# Altium schematic sheet TEMPLATE_Circuit.SchDoc
size Tabloid; Date: Date; Author: Author 1; Revision: 1; SheetNumber: 3; SheetTotal: 3; Size: 11x17; Sheet_Name: Circuit
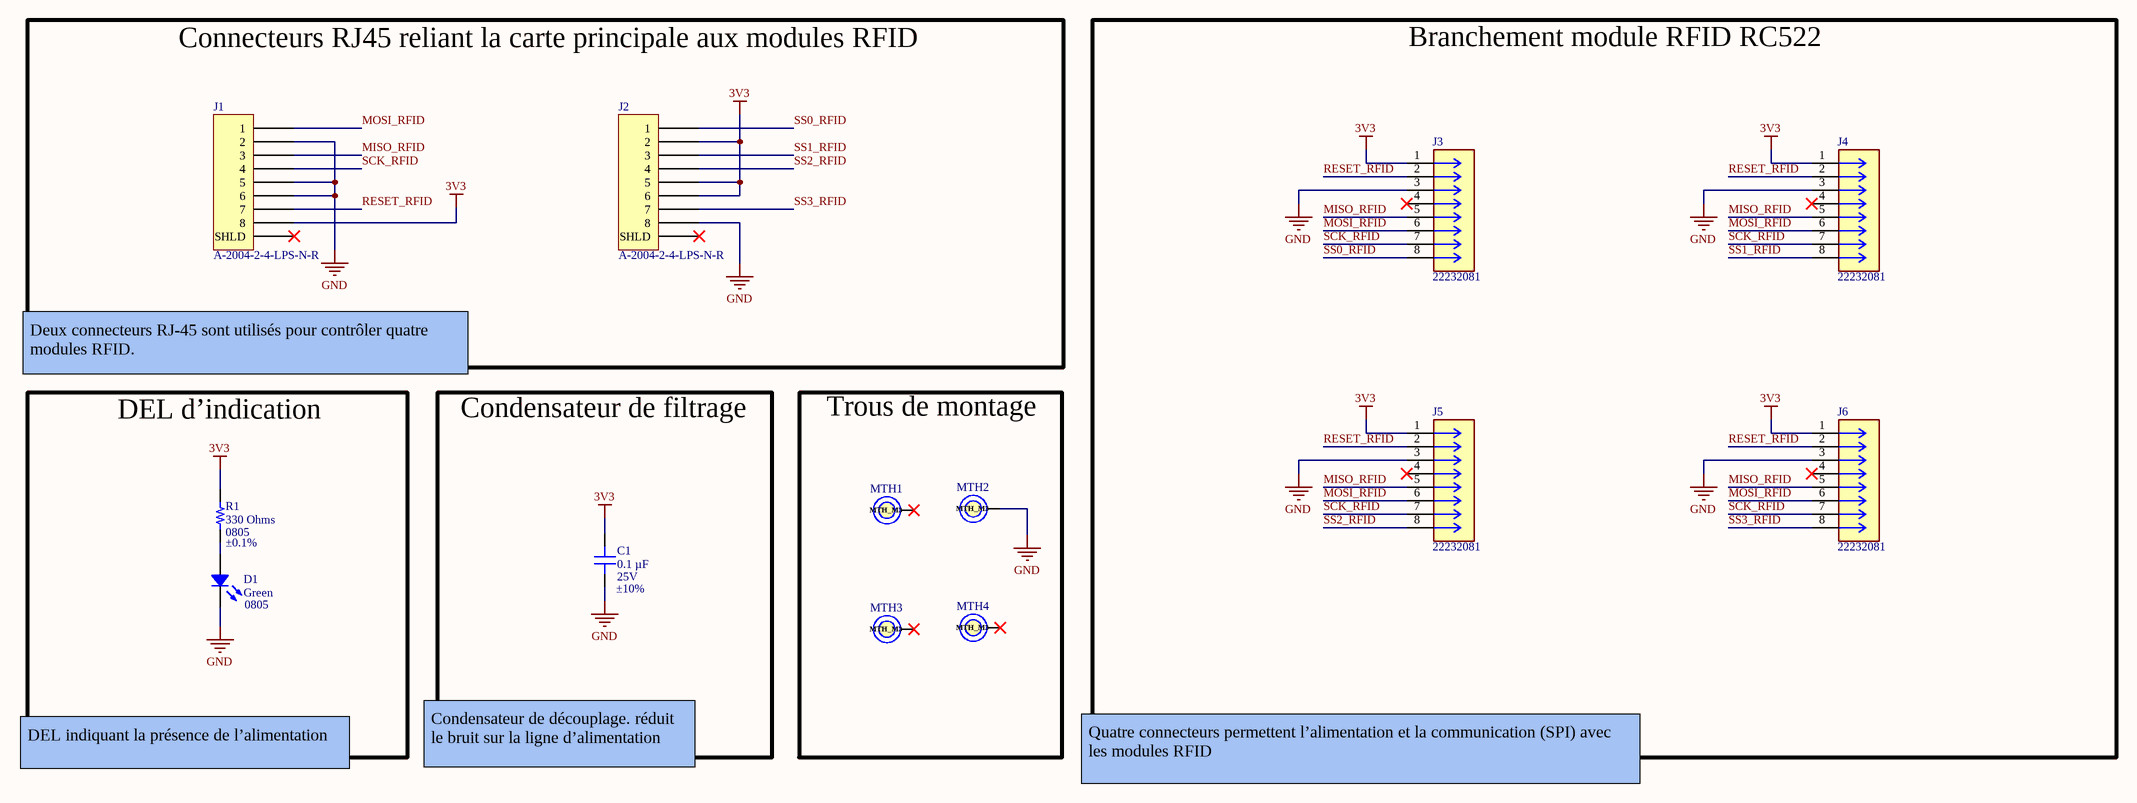
[diagram p0: TEMPLATE_Circuit.SchDoc]

## Parts
C1  Tolerance: ±10%  Voltage - Rated: 25V  [CAP 0805_2012]  (hidden comment: 0.1 µF)
D1  Green  Supplier Device Package: 0805  [LED 0805_2012 GREEN]
J1  A-2004-2-4-LPS-N-R  [ASSMANN A-2004-2-4-LPS-N-R]
J2  A-2004-2-4-LPS-N-R  [ASSMANN A-2004-2-4-LPS-N-R]
J3  22232081  [CONN_A-6373-08A_MOL]
J4  22232081  [CONN_A-6373-08A_MOL]
J5  22232081  [CONN_A-6373-08A_MOL]
J6  22232081  [CONN_A-6373-08A_MOL]
MTH1  MTH_M3  [MTH_M3]  (no BOM)
MTH2  MTH_M3  [MTH_M3]  (no BOM)
MTH3  MTH_M3  [MTH_M3]  (no BOM)
MTH4  MTH_M3  [MTH_M3]  (no BOM)
R1  Supplier Device Package: 0805  Tolerance: ±0.1%  [RES 0805_2012]  (hidden comment: 330 Ohms)

## Blocks framed on the sheet
Branchement module RFID RC522: J3-J6
DEL d’indication: D1 R1
Condensateur de filtrage: C1
Trous de montage: MTH1-MTH4

## Nets
3V3: C1.2 J1.8 J2.2 J2.5 J2.6 J3.1 J4.1 J5.1 J6.1 R1.2
GND: C1.1 D1.2 J1.2 J1.5 J1.6 J2.8 J3.3 J4.3 J5.3 J6.3 MTH2.1
MISO_RFID: J1.3 J3.5 J4.5 J5.5 J6.5
MOSI_RFID: J1.1 J3.6 J4.6 J5.6 J6.6
RESET_RFID: J1.7 J3.2 J4.2 J5.2 J6.2
SCK_RFID: J1.4 J3.7 J4.7 J5.7 J6.7
SS0_RFID: J2.1 J3.8
SS1_RFID: J2.3 J4.8
SS2_RFID: J2.4 J5.8
SS3_RFID: J2.7 J6.8
NetD1_1: D1.1 R1.1

Not connected (* = marked no-connect by the designer): J1 S(SHLD)*; J2 S(SHLD)*; J3 4*; J4 4*; J5 4*; J6 4*; MTH1 1*; MTH3 1*; MTH4 1*

## Notes on the sheet
- Connecteurs RJ45 reliant la carte principale aux modules RFID
- Deux connecteurs RJ-45 sont utilisés pour contrôler quatre modules RFID.
- DEL indiquant la présence de l’alimentation
- Condensateur de découplage. réduit le bruit sur la ligne d’alimentation
- Quatre connecteurs permettent l’alimentation et la communication (SPI) avec les modules RFID
- Nom de la feuille
- Titre du projet
- Cours associé au projet
- Taille
- Département
- Technologies du
- Révision
- PCB
- .
- SCH
- Date
- génie électrique
- Feuille
- Variant
- de
- Concepteurs

## Library data of the parts
C1 = 0805J0250104KXT: CAP CER 0.1UF 25V X7R 0805; manufacturer: Knowles Syfer; Part Number: 0805J0250104KXT; Capacitance: 0.1 µF; Applications: General Purpose; componentlink1description: Datasheet; componentlink1url: https://www.knowlescapacitors.com/getattachment/2dbfc8bc-e2b3-4b4d-afb1-43b011b9ebe0/High-Std-Voltage.aspx; componentlink2description: DigiKey Link; componentlink2url: https://www.digikey.com/en/products/detail/knowles-syfer/0805J0250104KXT/6304940; Device Package: 0805 (2012 Metric); lastupdated: 2024-02-09 8:13:16 PM; Lifecycle Status: Active; Minimum Order: 1; Mounting Type: Surface Mount, MLCC; Operating Temperature: -55°C ~ 125°C; Package / Case: 0805 (2012 Metric); packaging: TapeAndReel; partid: 57221; price: 0.08; series: -; Size / Dimension: 0.079" L x 0.049" W (2.00mm x 1.25mm); Supplier 1: DigiKey; Supplier Part Number 1: 1608-0805J0250104KXTCT-ND; Temperature Coefficient: X7R; Thickness (Max): 0.051" (1.30mm); value: 0.1 µF
D1 = 5975316507F: LED GREEN 0805 SMD; Manufacturer: Dialight; Configuration: Standard; Current - Test: 20mA; Lens Color: 0.93mm; Lens Size: 1.40mm x 1.24mm; Lens Style: Rectangle with Flat Top; Millicandela Rating: 16mcd; Voltage - Forward (Vf) (Typ): 2.2V; Wavelength - Dominant: 560nm; Part Number: 5975316507F; Color: Green; ComponentLink1Description: Datasheet; ComponentLink1URL: http://www.dialightsignalsandcomponents.com/Assets/Drawings/2D_Drawings_DrawingDetailedSpec/NewDrawings/18370A.pdf; ComponentLink2Description: DigiKey Link; ComponentLink2URL: https://www.digikey.com/en/products/detail/dialight/5975316507F/9385444; Height (Max): 0.93mm; LastUpdated: 2024-06-03 8:00:30 PM; Lifecycle Status: Active; Minimum Order: 1; Mounting Type: Surface Mount; Package / Case: 0805 (2012 Metric); Packaging: TapeAndReel; PartId: 245; Part Status: Active; Price: 0.12; Series: 597; Size / Dimension: 2.00mm L x 1.25mm W; Supplier 1: DigiKey; Supplier Part Number 1: 350-4389-1-ND; Value: Green
J1 J2 = A-2004-2-4-LPS-N-R: CONN MOD JACK 8P8C R/A SHIELDED; Manufacturer: Assmann WSW Components; LED Color: Does Not Contain LED; Number of Ports: 1; Number of Positions/Contacts: 8p8c (RJ45, Ethernet); Tab Direction: Down; Part Number: A-2004-2-4-LPS-N-R; ComponentLink1Description: Datasheet; ComponentLink1URL: http://www.assmann-wsw.com/fileadmin/datasheets/ASS_7323_CO.pdf; ComponentLink2Description: DigiKey Link; ComponentLink2URL: http://digikey.com/product-detail/en/assmann-wsw-components/A-2004-2-4-LPS-N-R/AE10387-ND/2183638; Connector Type: Jack; Contact Finish: Gold; Contact Material: Phosphor Bronze; Features: Board Lock; LastUpdated: 2020-01-15 3:54:20 AM; Lifecycle Status: Active; Minimum Order: 1; Mounting Type: Through Hole; Number of Rows: 1; Orientation: 90° Angle (Right); Packaging: Tray; Part Status: Active; Price: 1.05; Series: -; Shielding: Shielded; Supplier 1: DigiKey; Supplier Part Number 1: AE10387-ND; Termination: Solder
MTH1-MTH4 = CMP-006-000008-2: MTH - MOUNTING HOLE M3 PLATED - M3; HelpURL: https://littlemachineshop.com/images/gallery/PDF/TapDrillSizes.pdf; Assembly Type: NONE; Package: M3; Part Number #1: *; Power Max: *; Polarized: *; Design Item ID: MTH_M3; Pin Count: 1; Manufacturer #1: *; Component Type: Standard (No BOM); Value: *; Note: *; Source: CEGEP_SHERBROOKE_TGE_LIBRARY.SchLib
R1 = ERJ-PB6B3300V: RES SMD 330 OHM 0.1% 1/4W 0805; Manufacturer: Panasonic Electronic Components; Power (Watts): 0.25W, 1/4W; Temperature Coefficient: ±50ppm/°C; Part Number: ERJ-PB6B3300V; Value: 330 Ohms; ComponentLink1Description: Datasheet; ComponentLink1URL: https://industrial.panasonic.com/cdbs/www-data/pdf/RDM0000/AOA0000C328.pdf; ComponentLink2Description: DigiKey Link; ComponentLink2URL: https://www.digikey.com/en/products/detail/panasonic-electronic-components/ERJ-PB6B3300V/6213320; Composition: Thick Film; Device Package: 0805 (2012 Metric); Features: Automotive AEC-Q200, Pulse Withstanding; Height - Seated (Max): 0.028" (0.70mm); LastUpdated: 2024-02-08 9:02:05 PM; Lifecycle Status: Active; Minimum Order: 1; Number of Terminations: 2; Operating Temperature: -55°C ~ 155°C; Package / Case: 0805 (2012 Metric); Packaging: TapeAndReel; PartId: 35583; Part Status: Active; Price: 0.04; Ratings: AEC-Q200; Resistance: 330 Ohms; Series: ERJ-PB6; Size / Dimension: 0.079" L x 0.049" W (2.00mm x 1.25mm); Supplier 1: DigiKey; Supplier Part Number 1: P20537CT-ND
J3-J6 = 22232081: Package: None; Price: None; Value: *; MP: 22232081; Availability: Unavailable